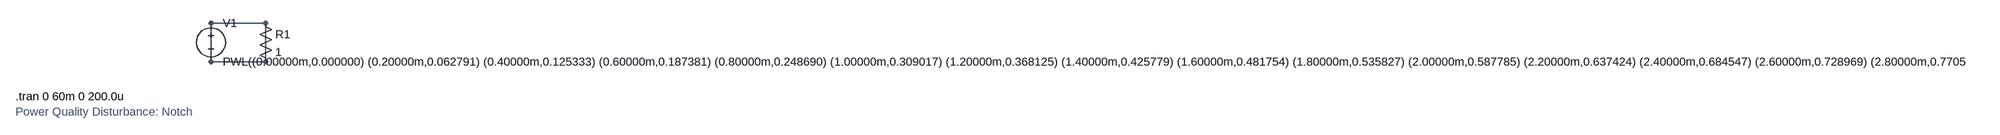
[diagram p0: schematic Notch.asc]
Notch.asc, the LTspice schematic file:
Version 4
SHEET 1 880 680
WIRE 192 128 80 128
WIRE 80 128 80 208
WIRE 192 208 80 208
WIRE 192 128 192 208
SYMBOL voltage 80 112 R0
WINDOW 123 0 0 Left 0
WINDOW 39 0 0 Left 0
SYMATTR InstName V1
SYMATTR Value PWL((0.00000m,0.000000) (0.20000m,0.062791) (0.40000m,0.125333) (0.60000m,0.187381) (0.80000m,0.248690) (1.00000m,0.309017) (1.20000m,0.368125) (1.40000m,0.425779) (1.60000m,0.481754) (1.80000m,0.535827) (2.00000m,0.587785) (2.20000m,0.637424) (2.40000m,0.684547) (2.60000m,0.728969) (2.80000m,0.770513) (3.00000m,0.809017) (3.20000m,0.844328) (3.40000m,0.876307) (3.60000m,0.904827) (3.80000m,0.929776) (4.00000m,0.951057) (4.20000m,0.968583) (4.40000m,0.982287) (4.60000m,0.992115) (4.80000m,0.998027) (5.00000m,0.120000) (5.20000m,0.119763) (5.40000m,0.119054) (5.60000m,0.117874) (5.80000m,0.116230) (6.00000m,0.951057) (6.20000m,0.929776) (6.40000m,0.904827) (6.60000m,0.876307) (6.80000m,0.844328) (7.00000m,0.809017) (7.20000m,0.770513) (7.40000m,0.728969) (7.60000m,0.684547) (7.80000m,0.637424) (8.00000m,0.587785) (8.20000m,0.535827) (8.40000m,0.481754) (8.60000m,0.425779) (8.80000m,0.368125) (9.00000m,0.309017) (9.20000m,0.248690) (9.40000m,0.187381) (9.60000m,0.125333) (9.80000m,0.062791) (10.00000m,0.000000) (10.20000m,-0.062791) (10.40000m,-0.125333) (10.60000m,-0.187381) (10.80000m,-0.248690) (11.00000m,-0.309017) (11.20000m,-0.368125) (11.40000m,-0.425779) (11.60000m,-0.481754) (11.80000m,-0.535827) (12.00000m,-0.587785) (12.20000m,-0.637424) (12.40000m,-0.684547) (12.60000m,-0.728969) (12.80000m,-0.770513) (13.00000m,-0.809017) (13.20000m,-0.844328) (13.40000m,-0.876307) (13.60000m,-0.904827) (13.80000m,-0.929776) (14.00000m,-0.951057) (14.20000m,-0.968583) (14.40000m,-0.982287) (14.60000m,-0.992115) (14.80000m,-0.998027) (15.00000m,-1.000000) (15.20000m,-0.998027) (15.40000m,-0.992115) (15.60000m,-0.982287) (15.80000m,-0.968583) (16.00000m,-0.951057) (16.20000m,-0.929776) (16.40000m,-0.904827) (16.60000m,-0.876307) (16.80000m,-0.844328) (17.00000m,-0.809017) (17.20000m,-0.770513) (17.40000m,-0.728969) (17.60000m,-0.684547) (17.80000m,-0.637424) (18.00000m,-0.587785) (18.20000m,-0.535827) (18.40000m,-0.481754) (18.60000m,-0.425779) (18.80000m,-0.368125) (19.00000m,-0.309017) (19.20000m,-0.248690) (19.40000m,-0.187381) (19.60000m,-0.125333) (19.80000m,-0.062791) (20.00000m,-0.000000) (20.20000m,0.062791) (20.40000m,0.125333) (20.60000m,0.187381) (20.80000m,0.248690) (21.00000m,0.309017) (21.20000m,0.368125) (21.40000m,0.425779) (21.60000m,0.481754) (21.80000m,0.535827) (22.00000m,0.587785) (22.20000m,0.637424) (22.40000m,0.684547) (22.60000m,0.728969) (22.80000m,0.770513) (23.00000m,0.809017) (23.20000m,0.844328) (23.40000m,0.876307) (23.60000m,0.904827) (23.80000m,0.929776) (24.00000m,0.951057) (24.20000m,0.968583) (24.40000m,0.982287) (24.60000m,0.992115) (24.80000m,0.998027) (25.00000m,0.120000) (25.20000m,0.119763) (25.40000m,0.119054) (25.60000m,0.117874) (25.80000m,0.116230) (26.00000m,0.951057) (26.20000m,0.929776) (26.40000m,0.904827) (26.60000m,0.876307) (26.80000m,0.844328) (27.00000m,0.809017) (27.20000m,0.770513) (27.40000m,0.728969) (27.60000m,0.684547) (27.80000m,0.637424) (28.00000m,0.587785) (28.20000m,0.535827) (28.40000m,0.481754) (28.60000m,0.425779) (28.80000m,0.368125) (29.00000m,0.309017) (29.20000m,0.248690) (29.40000m,0.187381) (29.60000m,0.125333) (29.80000m,0.062791) (30.00000m,0.000000) (30.20000m,-0.062791) (30.40000m,-0.125333) (30.60000m,-0.187381) (30.80000m,-0.248690) (31.00000m,-0.309017) (31.20000m,-0.368125) (31.40000m,-0.425779) (31.60000m,-0.481754) (31.80000m,-0.535827) (32.00000m,-0.587785) (32.20000m,-0.637424) (32.40000m,-0.684547) (32.60000m,-0.728969) (32.80000m,-0.770513) (33.00000m,-0.809017) (33.20000m,-0.844328) (33.40000m,-0.876307) (33.60000m,-0.904827) (33.80000m,-0.929776) (34.00000m,-0.951057) (34.20000m,-0.968583) (34.40000m,-0.982287) (34.60000m,-0.992115) (34.80000m,-0.998027) (35.00000m,-1.000000) (35.20000m,-0.998027) (35.40000m,-0.992115) (35.60000m,-0.982287) (35.80000m,-0.968583) (36.00000m,-0.951057) (36.20000m,-0.929776) (36.40000m,-0.904827) (36.60000m,-0.876307) (36.80000m,-0.844328) (37.00000m,-0.809017) (37.20000m,-0.770513) (37.40000m,-0.728969) (37.60000m,-0.684547) (37.80000m,-0.637424) (38.00000m,-0.587785) (38.20000m,-0.535827) (38.40000m,-0.481754) (38.60000m,-0.425779) (38.80000m,-0.368125) (39.00000m,-0.309017) (39.20000m,-0.248690) (39.40000m,-0.187381) (39.60000m,-0.125333) (39.80000m,-0.062791) (40.00000m,-0.000000) (40.20000m,0.062791) (40.40000m,0.125333) (40.60000m,0.187381) (40.80000m,0.248690) (41.00000m,0.309017) (41.20000m,0.368125) (41.40000m,0.425779) (41.60000m,0.481754) (41.80000m,0.535827) (42.00000m,0.587785) (42.20000m,0.637424) (42.40000m,0.684547) (42.60000m,0.728969) (42.80000m,0.770513) (43.00000m,0.809017) (43.20000m,0.844328) (43.40000m,0.876307) (43.60000m,0.904827) (43.80000m,0.929776) (44.00000m,0.951057) (44.20000m,0.968583) (44.40000m,0.982287) (44.60000m,0.992115) (44.80000m,0.998027) (45.00000m,0.120000) (45.20000m,0.119763) (45.40000m,0.119054) (45.60000m,0.117874) (45.80000m,0.116230) (46.00000m,0.951057) (46.20000m,0.929776) (46.40000m,0.904827) (46.60000m,0.876307) (46.80000m,0.844328) (47.00000m,0.809017) (47.20000m,0.770513) (47.40000m,0.728969) (47.60000m,0.684547) (47.80000m,0.637424) (48.00000m,0.587785) (48.20000m,0.535827) (48.40000m,0.481754) (48.60000m,0.425779) (48.80000m,0.368125) (49.00000m,0.309017) (49.20000m,0.248690) (49.40000m,0.187381) (49.60000m,0.125333) (49.80000m,0.062791) (50.00000m,0.000000) (50.20000m,-0.062791) (50.40000m,-0.125333) (50.60000m,-0.187381) (50.80000m,-0.248690) (51.00000m,-0.309017) (51.20000m,-0.368125) (51.40000m,-0.425779) (51.60000m,-0.481754) (51.80000m,-0.535827) (52.00000m,-0.587785) (52.20000m,-0.637424) (52.40000m,-0.684547) (52.60000m,-0.728969) (52.80000m,-0.770513) (53.00000m,-0.809017) (53.20000m,-0.844328) (53.40000m,-0.876307) (53.60000m,-0.904827) (53.80000m,-0.929776) (54.00000m,-0.951057) (54.20000m,-0.968583) (54.40000m,-0.982287) (54.60000m,-0.992115) (54.80000m,-0.998027) (55.00000m,-1.000000) (55.20000m,-0.998027) (55.40000m,-0.992115) (55.60000m,-0.982287) (55.80000m,-0.968583) (56.00000m,-0.951057) (56.20000m,-0.929776) (56.40000m,-0.904827) (56.60000m,-0.876307) (56.80000m,-0.844328) (57.00000m,-0.809017) (57.20000m,-0.770513) (57.40000m,-0.728969) (57.60000m,-0.684547) (57.80000m,-0.637424) (58.00000m,-0.587785) (58.20000m,-0.535827) (58.40000m,-0.481754) (58.60000m,-0.425779) (58.80000m,-0.368125) (59.00000m,-0.309017) (59.20000m,-0.248690) (59.40000m,-0.187381) (59.60000m,-0.125333) (59.80000m,-0.062791))
SYMBOL res 176 112 R0
SYMATTR InstName R1
SYMATTR Value 1
TEXT -320 280 Left 2 !.tran 0 60m 0 200.0u
TEXT -320 312 Left 2 ;Power Quality Disturbance: Notch

The netlist it stands for:
* Notch.asc
V1 N001 N001 PWL((0.00000m,0.000000) (0.20000m,0.062791) (0.40000m,0.125333) (0.60000m,0.187381) (0.80000m,0.248690) (1.00000m,0.309017) (1.20000m,0.368125) (1.40000m,0.425779) (1.60000m,0.481754) (1.80000m,0.535827) (2.00000m,0.587785) (2.20000m,0.637424) (2.40000m,0.684547) (2.60000m,0.728969) (2.80000m,0.770513) (3.00000m,0.809017) (3.20000m,0.844328) (3.40000m,0.876307) (3.60000m,0.904827) (3.80000m,0.929776) (4.00000m,0.951057) (4.20000m,0.968583) (4.40000m,0.982287) (4.60000m,0.992115) (4.80000m,0.998027) (5.00000m,0.120000) (5.20000m,0.119763) (5.40000m,0.119054) (5.60000m,0.117874) (5.80000m,0.116230) (6.00000m,0.951057) (6.20000m,0.929776) (6.40000m,0.904827) (6.60000m,0.876307) (6.80000m,0.844328) (7.00000m,0.809017) (7.20000m,0.770513) (7.40000m,0.728969) (7.60000m,0.684547) (7.80000m,0.637424) (8.00000m,0.587785) (8.20000m,0.535827) (8.40000m,0.481754) (8.60000m,0.425779) (8.80000m,0.368125) (9.00000m,0.309017) (9.20000m,0.248690) (9.40000m,0.187381) (9.60000m,0.125333) (9.80000m,0.062791) (10.00000m,0.000000) (10.20000m,-0.062791) (10.40000m,-0.125333) (10.60000m,-0.187381) (10.80000m,-0.248690) (11.00000m,-0.309017) (11.20000m,-0.368125) (11.40000m,-0.425779) (11.60000m,-0.481754) (11.80000m,-0.535827) (12.00000m,-0.587785) (12.20000m,-0.637424) (12.40000m,-0.684547) (12.60000m,-0.728969) (12.80000m,-0.770513) (13.00000m,-0.809017) (13.20000m,-0.844328) (13.40000m,-0.876307) (13.60000m,-0.904827) (13.80000m,-0.929776) (14.00000m,-0.951057) (14.20000m,-0.968583) (14.40000m,-0.982287) (14.60000m,-0.992115) (14.80000m,-0.998027) (15.00000m,-1.000000) (15.20000m,-0.998027) (15.40000m,-0.992115) (15.60000m,-0.982287) (15.80000m,-0.968583) (16.00000m,-0.951057) (16.20000m,-0.929776) (16.40000m,-0.904827) (16.60000m,-0.876307) (16.80000m,-0.844328) (17.00000m,-0.809017) (17.20000m,-0.770513) (17.40000m,-0.728969) (17.60000m,-0.684547) (17.80000m,-0.637424) (18.00000m,-0.587785) (18.20000m,-0.535827) (18.40000m,-0.481754) (18.60000m,-0.425779) (18.80000m,-0.368125) (19.00000m,-0.309017) (19.20000m,-0.248690) (19.40000m,-0.187381) (19.60000m,-0.125333) (19.80000m,-0.062791) (20.00000m,-0.000000) (20.20000m,0.062791) (20.40000m,0.125333) (20.60000m,0.187381) (20.80000m,0.248690) (21.00000m,0.309017) (21.20000m,0.368125) (21.40000m,0.425779) (21.60000m,0.481754) (21.80000m,0.535827) (22.00000m,0.587785) (22.20000m,0.637424) (22.40000m,0.684547) (22.60000m,0.728969) (22.80000m,0.770513) (23.00000m,0.809017) (23.20000m,0.844328) (23.40000m,0.876307) (23.60000m,0.904827) (23.80000m,0.929776) (24.00000m,0.951057) (24.20000m,0.968583) (24.40000m,0.982287) (24.60000m,0.992115) (24.80000m,0.998027) (25.00000m,0.120000) (25.20000m,0.119763) (25.40000m,0.119054) (25.60000m,0.117874) (25.80000m,0.116230) (26.00000m,0.951057) (26.20000m,0.929776) (26.40000m,0.904827) (26.60000m,0.876307) (26.80000m,0.844328) (27.00000m,0.809017) (27.20000m,0.770513) (27.40000m,0.728969) (27.60000m,0.684547) (27.80000m,0.637424) (28.00000m,0.587785) (28.20000m,0.535827) (28.40000m,0.481754) (28.60000m,0.425779) (28.80000m,0.368125) (29.00000m,0.309017) (29.20000m,0.248690) (29.40000m,0.187381) (29.60000m,0.125333) (29.80000m,0.062791) (30.00000m,0.000000) (30.20000m,-0.062791) (30.40000m,-0.125333) (30.60000m,-0.187381) (30.80000m,-0.248690) (31.00000m,-0.309017) (31.20000m,-0.368125) (31.40000m,-0.425779) (31.60000m,-0.481754) (31.80000m,-0.535827) (32.00000m,-0.587785) (32.20000m,-0.637424) (32.40000m,-0.684547) (32.60000m,-0.728969) (32.80000m,-0.770513) (33.00000m,-0.809017) (33.20000m,-0.844328) (33.40000m,-0.876307) (33.60000m,-0.904827) (33.80000m,-0.929776) (34.00000m,-0.951057) (34.20000m,-0.968583) (34.40000m,-0.982287) (34.60000m,-0.992115) (34.80000m,-0.998027) (35.00000m,-1.000000) (35.20000m,-0.998027) (35.40000m,-0.992115) (35.60000m,-0.982287) (35.80000m,-0.968583) (36.00000m,-0.951057) (36.20000m,-0.929776) (36.40000m,-0.904827) (36.60000m,-0.876307) (36.80000m,-0.844328) (37.00000m,-0.809017) (37.20000m,-0.770513) (37.40000m,-0.728969) (37.60000m,-0.684547) (37.80000m,-0.637424) (38.00000m,-0.587785) (38.20000m,-0.535827) (38.40000m,-0.481754) (38.60000m,-0.425779) (38.80000m,-0.368125) (39.00000m,-0.309017) (39.20000m,-0.248690) (39.40000m,-0.187381) (39.60000m,-0.125333) (39.80000m,-0.062791) (40.00000m,-0.000000) (40.20000m,0.062791) (40.40000m,0.125333) (40.60000m,0.187381) (40.80000m,0.248690) (41.00000m,0.309017) (41.20000m,0.368125) (41.40000m,0.425779) (41.60000m,0.481754) (41.80000m,0.535827) (42.00000m,0.587785) (42.20000m,0.637424) (42.40000m,0.684547) (42.60000m,0.728969) (42.80000m,0.770513) (43.00000m,0.809017) (43.20000m,0.844328) (43.40000m,0.876307) (43.60000m,0.904827) (43.80000m,0.929776) (44.00000m,0.951057) (44.20000m,0.968583) (44.40000m,0.982287) (44.60000m,0.992115) (44.80000m,0.998027) (45.00000m,0.120000) (45.20000m,0.119763) (45.40000m,0.119054) (45.60000m,0.117874) (45.80000m,0.116230) (46.00000m,0.951057) (46.20000m,0.929776) (46.40000m,0.904827) (46.60000m,0.876307) (46.80000m,0.844328) (47.00000m,0.809017) (47.20000m,0.770513) (47.40000m,0.728969) (47.60000m,0.684547) (47.80000m,0.637424) (48.00000m,0.587785) (48.20000m,0.535827) (48.40000m,0.481754) (48.60000m,0.425779) (48.80000m,0.368125) (49.00000m,0.309017) (49.20000m,0.248690) (49.40000m,0.187381) (49.60000m,0.125333) (49.80000m,0.062791) (50.00000m,0.000000) (50.20000m,-0.062791) (50.40000m,-0.125333) (50.60000m,-0.187381) (50.80000m,-0.248690) (51.00000m,-0.309017) (51.20000m,-0.368125) (51.40000m,-0.425779) (51.60000m,-0.481754) (51.80000m,-0.535827) (52.00000m,-0.587785) (52.20000m,-0.637424) (52.40000m,-0.684547) (52.60000m,-0.728969) (52.80000m,-0.770513) (53.00000m,-0.809017) (53.20000m,-0.844328) (53.40000m,-0.876307) (53.60000m,-0.904827) (53.80000m,-0.929776) (54.00000m,-0.951057) (54.20000m,-0.968583) (54.40000m,-0.982287) (54.60000m,-0.992115) (54.80000m,-0.998027) (55.00000m,-1.000000) (55.20000m,-0.998027) (55.40000m,-0.992115) (55.60000m,-0.982287) (55.80000m,-0.968583) (56.00000m,-0.951057) (56.20000m,-0.929776) (56.40000m,-0.904827) (56.60000m,-0.876307) (56.80000m,-0.844328) (57.00000m,-0.809017) (57.20000m,-0.770513) (57.40000m,-0.728969) (57.60000m,-0.684547) (57.80000m,-0.637424) (58.00000m,-0.587785) (58.20000m,-0.535827) (58.40000m,-0.481754) (58.60000m,-0.425779) (58.80000m,-0.368125) (59.00000m,-0.309017) (59.20000m,-0.248690) (59.40000m,-0.187381) (59.60000m,-0.125333) (59.80000m,-0.062791))
R1 N001 N001 1
.tran 0 60m 0 200.0u
* Power Quality Disturbance: Notch
.backanno
.end